# EAGLE schematic mega_shield_0_1 (EAGLE 6.5.0)
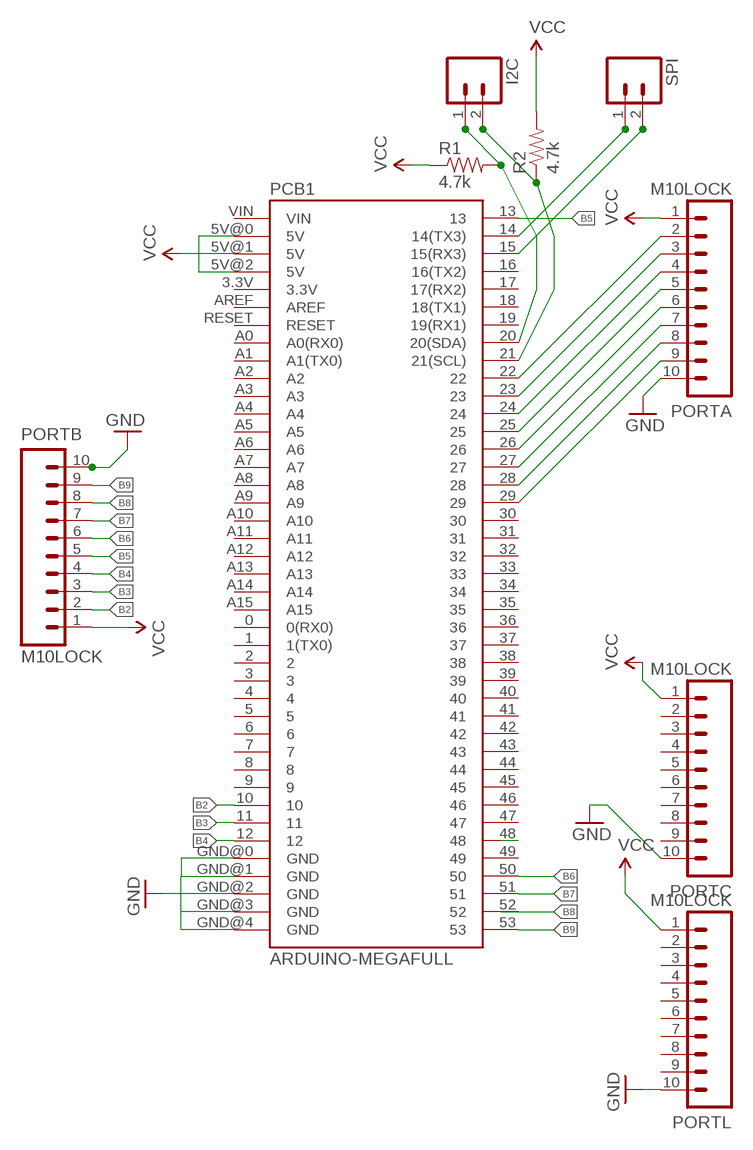
[diagram p0: schematic, sheet 1]

## Parts
I2C  M02PTH  [1X02]
PCB1  ARDUINO-MEGAFULL  [ARDUINO_MEGA]
PORTA  M10LOCK  [1X10_LOCK]
PORTB  M10LOCK  [1X10_LOCK]
PORTC  M10LOCK  [1X10_LOCK]
PORTL  M10LOCK  [1X10_LOCK]
R1  4.7k  RESISTORPTH1  [AXIAL-0.3]
R2  4.7k  RESISTORPTH1  [AXIAL-0.3]
SPI  M02PTH  [1X02]

## Nets
B2: PCB1.10 PORTB.2
B3: PCB1.11 PORTB.3
B4: PCB1.12 PORTB.4
B5: PCB1.13 PORTB.5
B6: PCB1.50 PORTB.6
B7: PCB1.51 PORTB.7
B8: PORTB.8
B9: PCB1.53 PORTB.9
GND: PCB1.GND@0(GND) PCB1.GND@1(GND) PCB1.GND@2(GND) PCB1.GND@3(GND) PCB1.GND@4(GND) PORTA.10 PORTB.10 PORTC.10 PORTL.10
N$1: PCB1.22 PORTA.2
N$2: PCB1.23 PORTA.3
N$3: PCB1.24 PORTA.4
N$4: PCB1.25 PORTA.5
N$5: PCB1.26 PORTA.6
N$6: PCB1.27 PORTA.7
N$7: PCB1.28 PORTA.8
N$8: PCB1.29 PORTA.9
N$9: PCB1.14(14(TX3)) SPI.1
N$10: PCB1.15(15(RX3)) SPI.2
N$35: I2C.1 PCB1.20(20(SDA)) R1.P$2
N$36: I2C.2 PCB1.21(21(SCL)) R2.P$1
VCC: PCB1.5V@0(5V) PCB1.5V@1(5V) PCB1.5V@2(5V) PORTA.1 PORTB.1 PORTC.1 PORTL.1 R1.P$1 R2.P$2
Unconnected: PCB1.0(0(RX0)) PCB1.1(1(TX0)) PCB1.2 PCB1.3 PCB1.3.3V PCB1.4 PCB1.5 PCB1.6 PCB1.7 PCB1.8 PCB1.9 PCB1.16(16(TX2)) PCB1.17(17(RX2)) PCB1.18(18(TX1)) PCB1.19(19(RX1)) PCB1.30 PCB1.31 PCB1.32 PCB1.33 PCB1.34 PCB1.35 PCB1.36 PCB1.37 PCB1.38 PCB1.39 PCB1.40 PCB1.41 PCB1.42 PCB1.43 PCB1.44 PCB1.45 PCB1.46 PCB1.47 PCB1.48 PCB1.49 PCB1.52 PCB1.A0(A0(RX0)) PCB1.A1(A1(TX0)) PCB1.A2 PCB1.A3 PCB1.A4 PCB1.A5 PCB1.A6 PCB1.A7 PCB1.A8 PCB1.A9 PCB1.A10 PCB1.A11 PCB1.A12 PCB1.A13 PCB1.A14 PCB1.A15 PCB1.AREF PCB1.RESET PCB1.VIN PORTC.2 PORTC.3 PORTC.4 PORTC.5 PORTC.6 PORTC.7 PORTC.8 PORTC.9 PORTL.2 PORTL.3 PORTL.4 PORTL.5 PORTL.6 PORTL.7 PORTL.8 PORTL.9

## Library data of the parts
I2C SPI = SparkFun:M02: Header 2 Standard 2-pin 0.1" header. Use with straight break away headers (SKU : PRT-00116), right angle break away headers (PRT-00553), swiss pins (PRT-00743), machine pins (PRT-00117), and female headers (PRT-00115). Molex polarized connector foot print use with SKU : PRT-08233 with associated crimp pins and housings.
PCB1 = SparkFun-Boards:ARDUINO-MEGA: Arduino Mega board footprint
PORTA PORTB PORTC PORTL = SparkFun:M10: Header 10 Standard 10-pin 0.1" header. Use with straight break away headers (SKU : PRT-00116), right angle break away headers (PRT-00553), swiss pins (PRT-00743), machine pins (PRT-00117), and female headers (PRT-00115).
R1 R2 = SparkFun:RESISTOR: Resistor Basic schematic elements and footprints for 0603, 1206, and PTH 1/10th watt (small) resistors.

## Net classes
0 default: width 0.178 mm, drill 0.254 mm, clearance 0.178 mm